# EAGLE design Schematic (EAGLE 5.11)
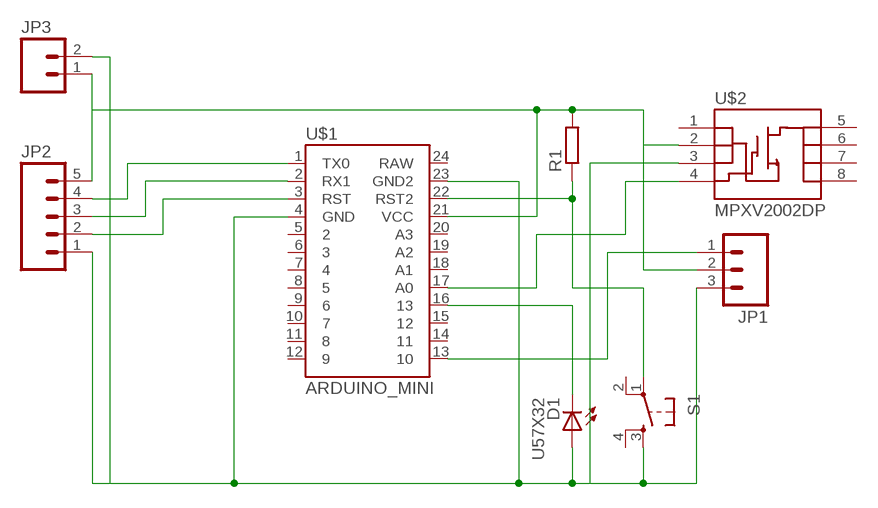
[diagram p0: schematic, sheet 1]

## Parts
D1  U57X32  [U57X32]
JP1  M03LONGPADS  [1X03_LONGPADS]
JP2  M05PTH_LONGPADS  [1X05_LONGPADS]
JP3  M02LOCK_LONGPADS  [1X02_LOCK_LONGPADS]
R1  R-EU_0204/7  [0204/7]
S1  TAC_SWITCHPTH  [TACTILE-PTH]
U$1  ARDUINO_MINI  [ARDUINO_MINI]
U$2  MPXV2002DP  MOSFET-NCHANNEL-SOIC8  [SO08]

## Nets
N$1: JP1.1 U$1.13
N$2: JP2.2 U$1.3(RST)
N$3: JP2.3 U$1.2(RX1)
N$4: JP2.4 U$1.1(TX0)
N$5: R1.1 S1.1 U$1.22(RST2)
N$6: D1.K(C) U$1.16
N$7: U$1.17(A0) U$2.4(G)
N$10: JP1.2 JP2.5 JP3.1 R1.2 U$1.21(VCC) U$2.2(S)
N$11: D1.A JP1.3 JP2.1 JP3.2 S1.3 U$1.4(GND) U$1.23(GND2) U$2.3(S)
Unconnected: S1.2 S1.4 U$1.5 U$1.6 U$1.7 U$1.8 U$1.9 U$1.10 U$1.11 U$1.12 U$1.14 U$1.15 U$1.18(A1) U$1.19(A2) U$1.20(A3) U$1.24(RAW) U$2.1(S) U$2.5(D) U$2.6(D) U$2.7(D) U$2.8(D)

## Library data of the parts
D1 = led:U57X32: LED rectangle, 5.7 x 3.2 mm
JP1 = SparkFun:M03: Header 3 Standard 3-pin 0.1" header. Use with straight break away headers (SKU : PRT-00116), right angle break away headers (PRT-00553), swiss pins (PRT-00743), machine pins (PRT-00117), and female headers (PRT-00115). Molex polarized connector foot print use with SKU : PRT-08232 with associated crimp pins and housings.
JP2 = SparkFun:M05: Header 5 Standard 5-pin 0.1" header. Use with straight break away headers (SKU : PRT-00116), right angle break away headers (PRT-00553), swiss pins (PRT-00743), machine pins (PRT-00117), and female headers (PRT-00115). Molex polarized connector foot print use with SKU : PRT-08230 with associated crimp pins and housings.
JP3 = SparkFun:M02: Header 2 Standard 2-pin 0.1" header. Use with straight break away headers (SKU : PRT-00116), right angle break away headers (PRT-00553), swiss pins (PRT-00743), machine pins (PRT-00117), and female headers (PRT-00115). Molex polarized connector foot print use with SKU : PRT-08233 with associated crimp pins and housings.
R1 = resistor:R-EU_: RESISTOR, European symbol
S1 = SparkFun:TAC_SWITCH: Momentary Switch Button commonly used for reset or general input. Spark Fun Electronics SKU : COM-00097
U$1 = SparkFun:ARDUINO_MINI
U$2 = SparkFun:MOSFET-NCHANNEL-SOIC8: N-Channel MOSFET IRF9410 and NDS8434 are common, SOIC-8 parts.

## Board
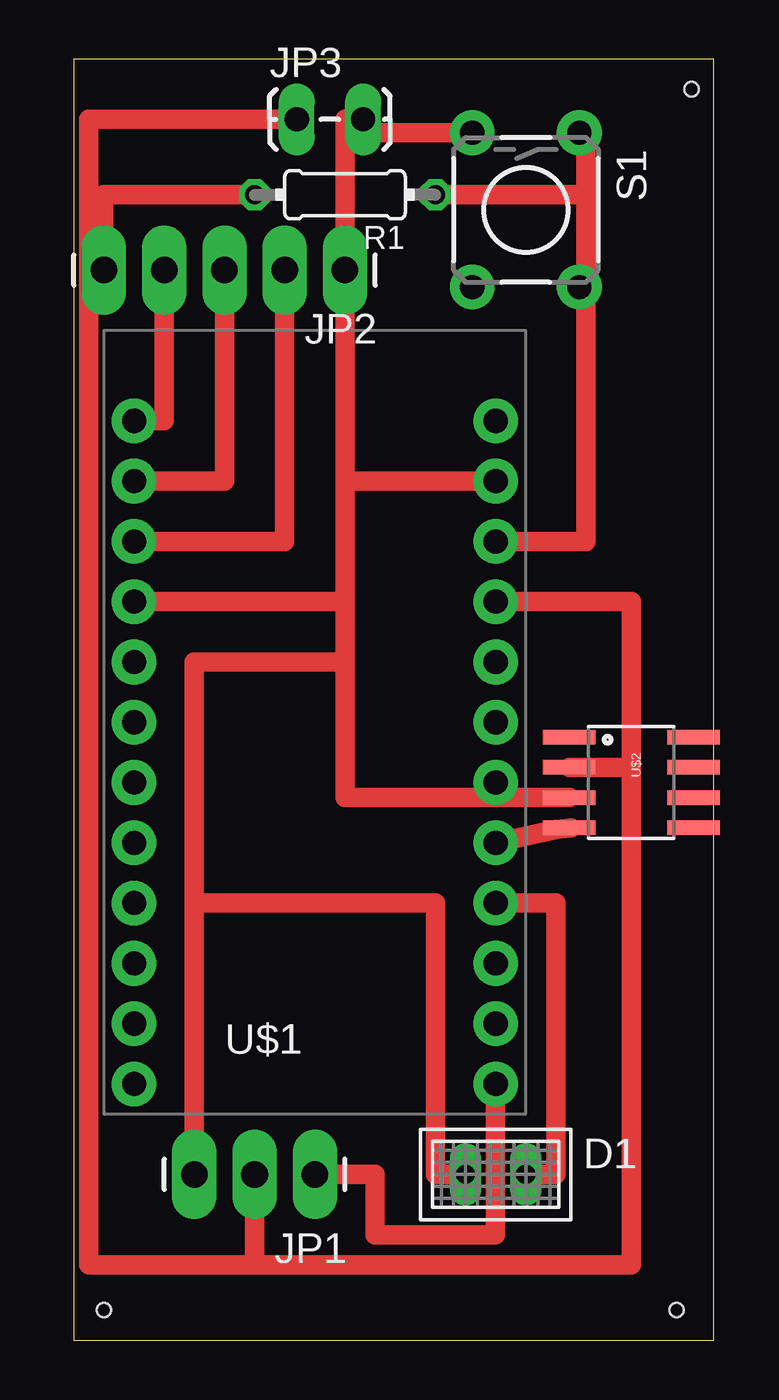
[diagram p1: board, top side]

Size 26.98 x 53.97 mm. Coordinates in mm from the lower left corner, seen from the top.
Outline: 0,0 26.98,0 26.98,53.97 0,53.97 0,0
Copper layers (1*16): Top 0.035mm / dielectric 1.5mm / Bottom 0.035mm
Design rules "default": minimum track width 10mil, minimum drill 24mil, track to track 8mil, track to pad 8mil, pad to pad 8mil, via to via 8mil, smd to smd 8mil, copper to edge 40mil, drill to drill 8mil, minimum pad ring 10mil, minimum via ring 8mil, stop-mask expansion 4mil, vias tented up to drill 0mil, thermal gap 10mil
Holes 0.6 mm at 1.27,1.27 25.4,1.27 26.03,52.7

### Footprints (pad centres in the part's own frame; a part is rotated, then mirrored left to right if it is on the bottom)
U57X32 = drill 0.813 long: A -1.27,0; K 1.27,0
1X03_LONGPADS = drill 1.118 pad 1.88 long: 1 0,0; 2 2.54,0; 3 5.08,0
1X05_LONGPADS = drill 1.118 pad 1.88 long: 1 0,0; 2 2.54,0; 3 5.08,0; 4 7.62,0; 5 10.16,0
1X02_LOCK_LONGPADS = drill 1.016 long: 1 -0.127,0; 2 2.667,0
0204/7 = drill 0.813 octagon: 1 -3.81,0; 2 3.81,0
TACTILE-PTH = drill 1.016 pad 1.88 round: 1 -3.251,2.261; 2 3.251,2.261; 3 -3.251,-2.261; 4 3.251,-2.261
ARDUINO_MINI = drill 1.016 pad 1.88 round: 1 -7.62,12.7; 2 -7.62,10.16; 3 -7.62,7.62; 4 -7.62,5.08; 5 -7.62,2.54; 6 -7.62,0; 7 -7.62,-2.54; 8 -7.62,-5.08; 9 -7.62,-7.62; 10 -7.62,-10.16; 11 -7.62,-12.7; 12 -7.62,-15.24; 13 7.62,-15.24; 14 7.62,-12.7; 15 7.62,-10.16; 16 7.62,-7.62; 17 7.62,-5.08; 18 7.62,-2.54; 19 7.62,0; 20 7.62,2.54; 21 7.62,5.08; 22 7.62,7.62; 23 7.62,10.16; 24 7.62,12.7
SO08 = smd 0.61 x 2.21: 1 -1.905,-2.616; 2 -0.635,-2.616; 3 0.635,-2.616; 4 1.905,-2.616; 5 1.905,2.616; 6 0.635,2.616; 7 -0.635,2.616; 8 -1.905,2.616

### Placement (x,y rotation side)
D1  17.78,6.99 0 top
JP1  10.16,6.99 180 top
JP2  11.43,45.08 180 top
JP3  9.53,51.44 0 top
R1  11.43,48.26 180 top
S1  19.05,47.62 270 top
U$1  10.16,26.04 0 top
U$2  23.49,23.5 270 top

### Tracks (layer width: path | path; a pad name or v marks a point on that pad's centre or on a via)
N$1
  Top 0.813: JP1.1 12.7,6.99 12.7,4.45 17.78,4.45 U$1.13
N$2
  Top 0.813: JP2.2 8.89,33.66 U$1.3
N$3
  Top 0.813: JP2.3 6.35,36.19 U$1.2
N$4
  Top 0.813: U$1.1 3.81,38.73 JP2.4
N$5
  Top 0.813: 21.59,48.26 21.59,33.66 U$1.22 | S1.1 21.59,50.88 21.59,48.26 | 21.59,48.26 R1.1
N$6
  Top 0.813: D1.K 20.32,6.99 20.32,18.42 U$1.16
N$7
  Top 0.406: 20.32,21.51 U$2.4
  Top 0.813: U$1.17 20.32,21.51 20.95,21.59
N$10
  Top 0.813: 0.64,45.08 JP2.5 1.27,48.26 R1.2 | 0.64,45.08 0.64,3.18 7.62,3.18 | 7.62,3.18 JP1.2 | U$1.21 23.49,31.11 23.49,24.13 | 23.49,24.13 23.49,3.18 7.62,3.18 | 23.49,24.13 U$2.2 | JP3.1 0.64,51.44 0.64,45.08
N$11
  Top 0.813: 11.43,31.11 11.43,36.19 | 11.43,36.19 JP2.1 11.43,50.88 | 11.43,31.11 U$1.4 | 11.43,36.19 U$1.23 | 11.43,28.57 11.43,31.11 | 11.43,28.57 5.08,28.57 5.08,18.42 | JP1.3 5.08,18.42 | U$2.3 11.43,22.86 11.43,28.57 | 5.08,18.42 15.24,18.42 15.24,6.99 D1.A | JP3.2 11.43,51.44 11.43,50.88 | 11.43,50.88 S1.3